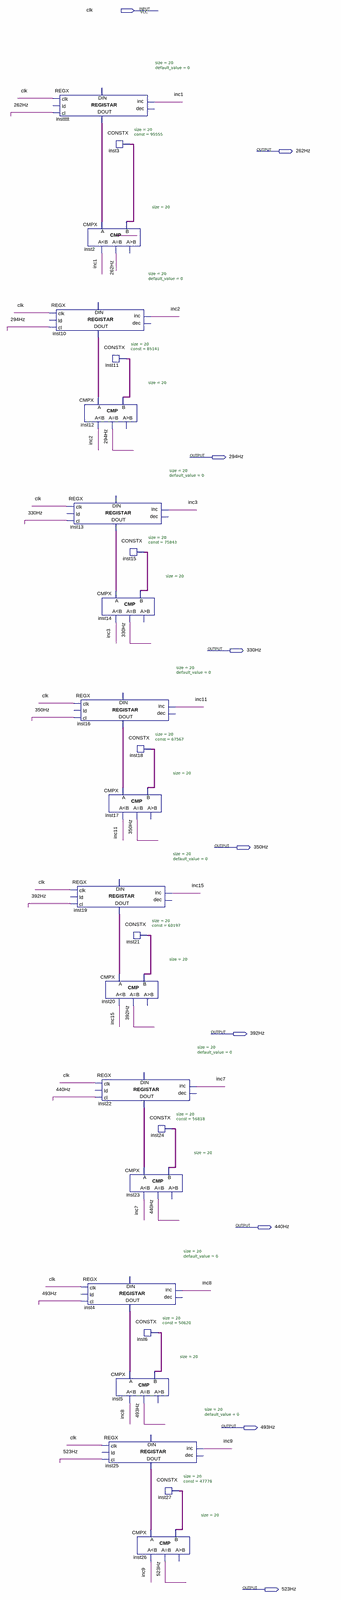
[diagram p0: schematic sheet, whole]
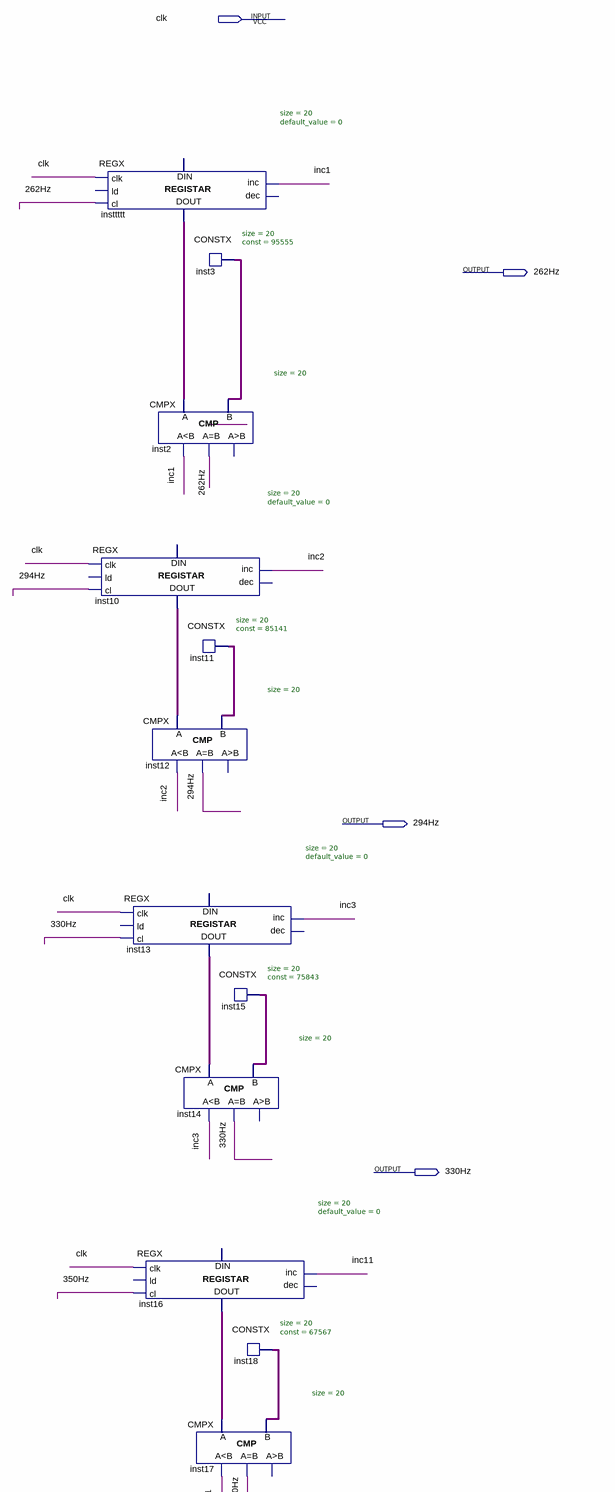
[diagram p1: schematic sheet, upper part]
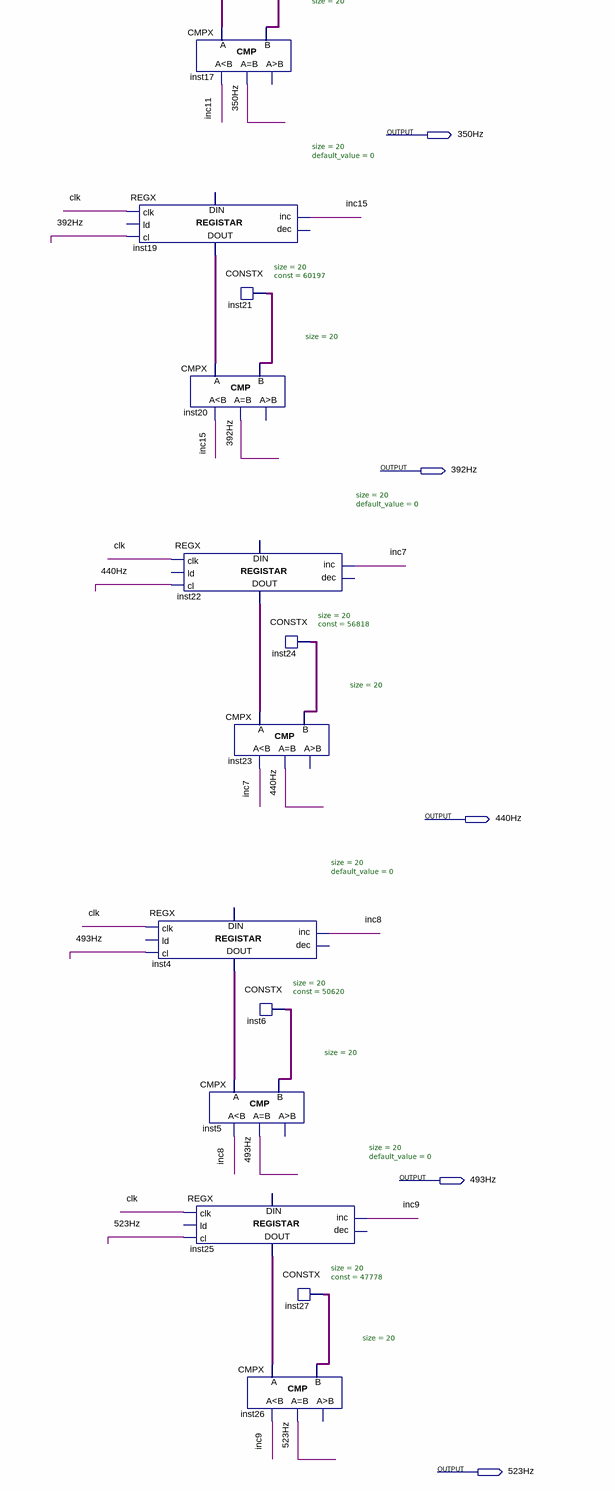
[diagram p2: schematic sheet, lower part]
// Quartus schematic frekvencije.bdf as structural Verilog: 24 symbols, 9 pins
module frekvencije (
  input  clk,
  output \262Hz ,
  output \294Hz ,
  output \330Hz ,
  output \350Hz ,
  output \392Hz ,
  output \440Hz ,
  output \493Hz ,
  output \523Hz 
);

  wire inc1, inc2, inc3, inc7, inc8, inc9, inc11, inc15;
  wire [19:0] inst3_data, inst4_data_out, inst6_data, inst10_data_out, inst11_data, inst13_data_out,
       inst15_data, inst16_data_out, inst18_data, inst19_data_out, inst21_data, inst22_data_out, inst24_data,
       inst25_data_out, inst27_data, insttttt_data_out;

  REGX #(.size(20), .default_value(0)) inst10 (
    .clk(clk), .cl(\294Hz ), .inc(inc2), .data_out(inst10_data_out));  // open: ld, dec, data_in
  REGX #(.size(20), .default_value(0)) insttttt (
    .clk(clk), .cl(\262Hz ), .inc(inc1), .data_out(insttttt_data_out));  // open: ld, dec, data_in
  CMPX #(.size(20)) inst12 (.A(inst10_data_out), .B(inst11_data), .ls(inc2), .eq(\294Hz ));  // open: gr
  REGX #(.size(20), .default_value(0)) inst13 (
    .clk(clk), .cl(\330Hz ), .inc(inc3), .data_out(inst13_data_out));  // open: ld, dec, data_in
  REGX #(.size(20), .default_value(0)) inst16 (
    .clk(clk), .cl(\350Hz ), .inc(inc11), .data_out(inst16_data_out));  // open: ld, dec, data_in
  REGX #(.size(20), .default_value(0)) inst19 (
    .clk(clk), .cl(\392Hz ), .inc(inc15), .data_out(inst19_data_out));  // open: ld, dec, data_in
  CONSTX #(.size(20), .\const (95555)) inst3 (.data(inst3_data));
  CMPX #(.size(20)) inst2 (.A(insttttt_data_out), .B(inst3_data), .ls(inc1), .eq(\262Hz ));  // open: gr
  CONSTX #(.size(20), .\const (85141)) inst11 (.data(inst11_data));
  CMPX #(.size(20)) inst14 (.A(inst13_data_out), .B(inst15_data), .ls(inc3), .eq(\330Hz ));  // open: gr
  CMPX #(.size(20)) inst17 (.A(inst16_data_out), .B(inst18_data), .ls(inc11), .eq(\350Hz ));  // open: gr
  CMPX #(.size(20)) inst20 (.A(inst19_data_out), .B(inst21_data), .ls(inc15), .eq(\392Hz ));  // open: gr
  REGX #(.size(20), .default_value(0)) inst22 (
    .clk(clk), .cl(\440Hz ), .inc(inc7), .data_out(inst22_data_out));  // open: ld, dec, data_in
  REGX #(.size(20), .default_value(0)) inst4 (
    .clk(clk), .cl(\493Hz ), .inc(inc8), .data_out(inst4_data_out));  // open: ld, dec, data_in
  REGX #(.size(20), .default_value(0)) inst25 (
    .clk(clk), .cl(\523Hz ), .inc(inc9), .data_out(inst25_data_out));  // open: ld, dec, data_in
  CONSTX #(.size(20), .\const (75843)) inst15 (.data(inst15_data));
  CONSTX #(.size(20), .\const (67567)) inst18 (.data(inst18_data));
  CONSTX #(.size(20), .\const (60197)) inst21 (.data(inst21_data));
  CMPX #(.size(20)) inst23 (.A(inst22_data_out), .B(inst24_data), .ls(inc7), .eq(\440Hz ));  // open: gr
  CONSTX #(.size(20), .\const (50620)) inst6 (.data(inst6_data));
  CMPX #(.size(20)) inst5 (.A(inst4_data_out), .B(inst6_data), .ls(inc8), .eq(\493Hz ));  // open: gr
  CMPX #(.size(20)) inst26 (.A(inst25_data_out), .B(inst27_data), .ls(inc9), .eq(\523Hz ));  // open: gr
  CONSTX #(.size(20), .\const (56818)) inst24 (.data(inst24_data));
  CONSTX #(.size(20), .\const (47778)) inst27 (.data(inst27_data));
endmodule
